# EAGLE design Ece 473 Lab 4 Pre-Amp (EAGLE 9.5.1)
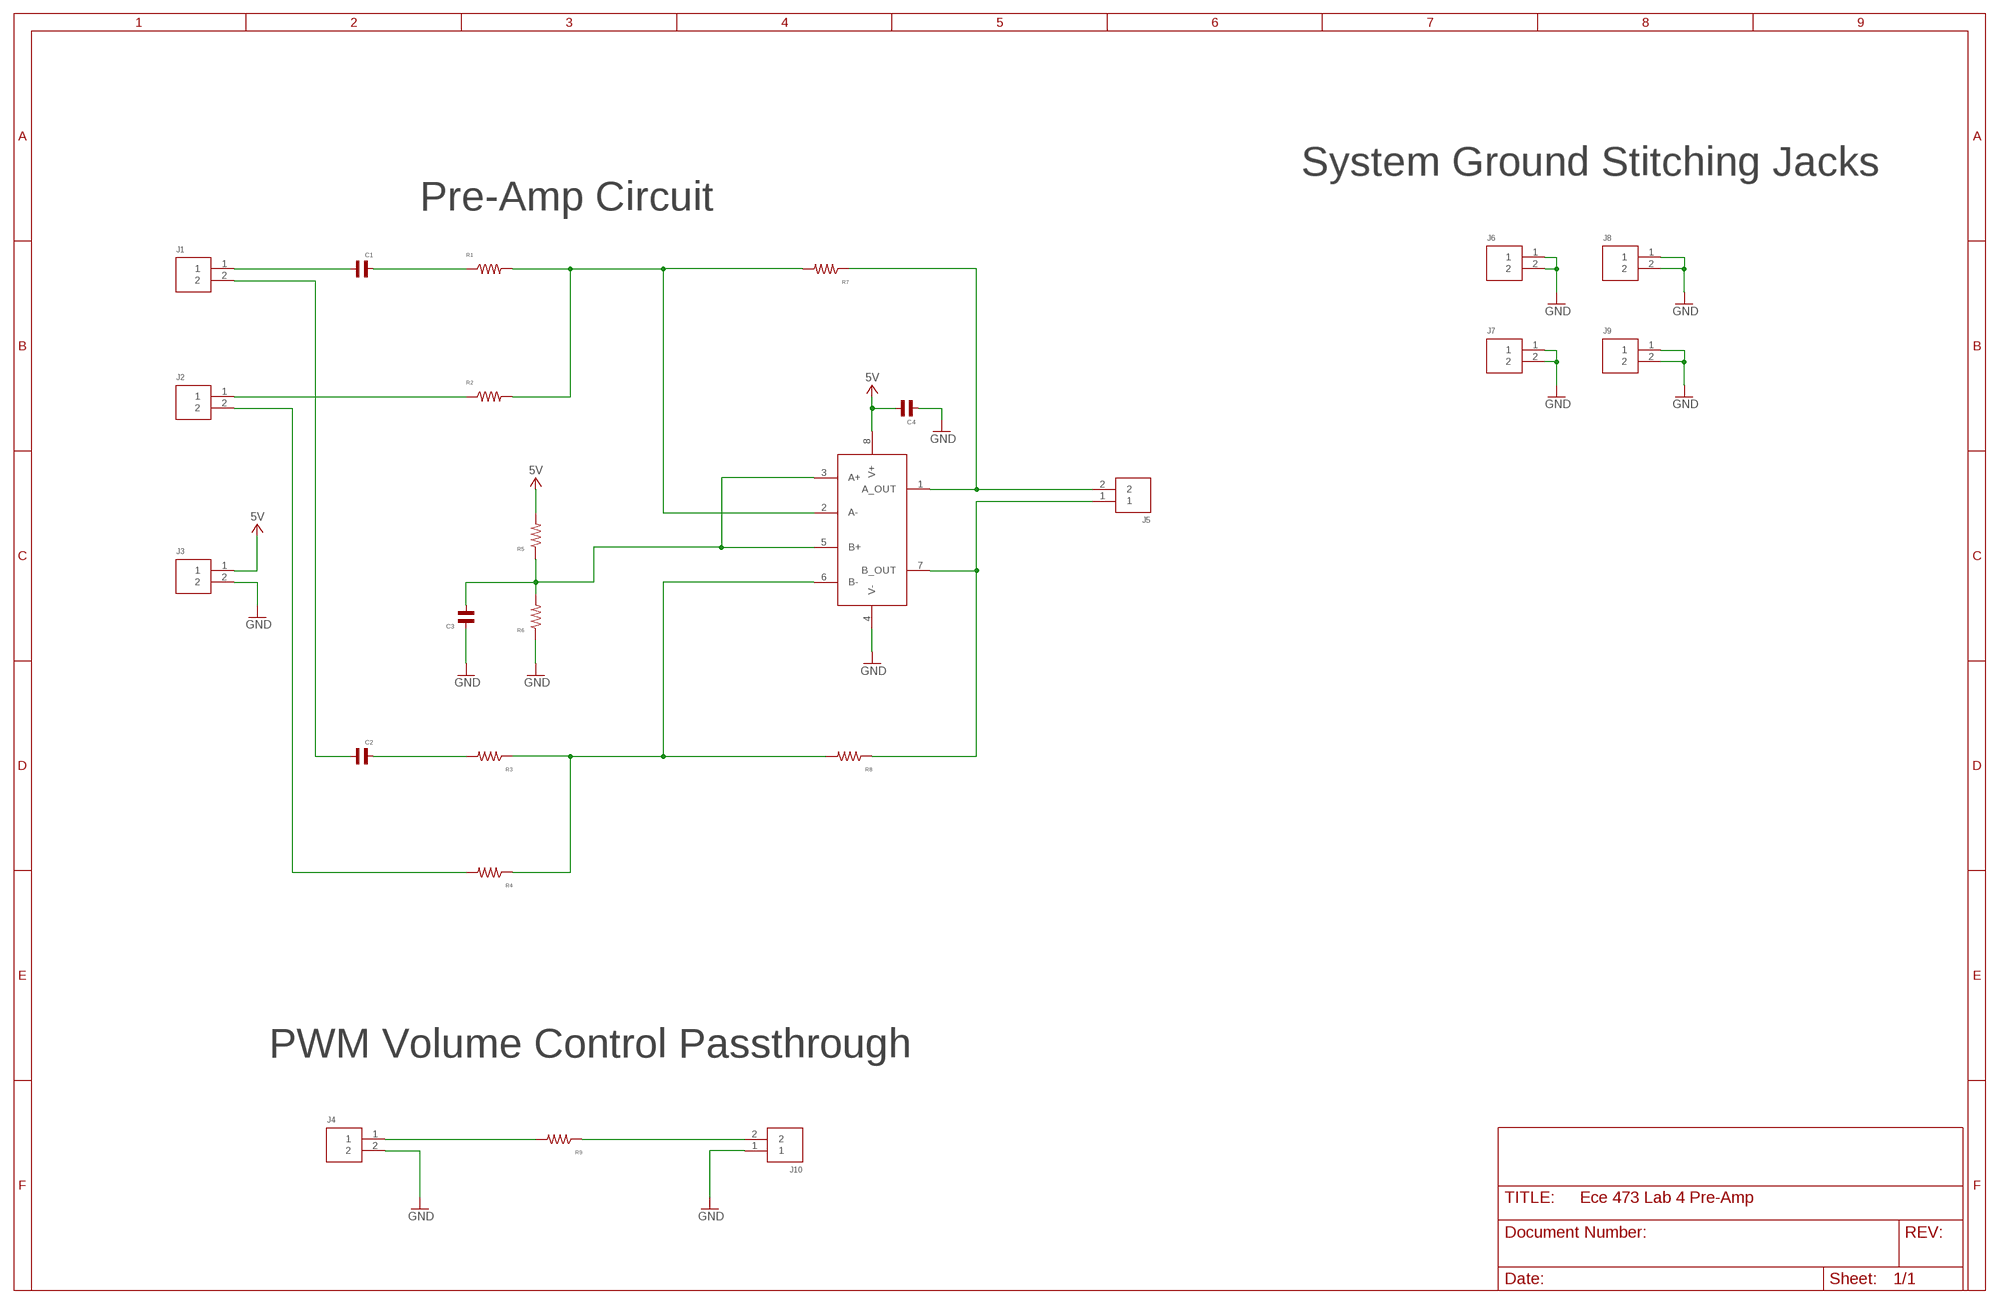
[diagram p0: schematic, sheet 1]

## Parts
C1  0.1uF  CAPACITOR_0.1UF_THROUGH-HOLE  [CAP_THROUGH-HOLE]
C2  0.1uF  CAPACITOR_0.1UF_THROUGH-HOLE  [CAP_THROUGH-HOLE]
C3  0.1uF  CAPACITOR_0.1UF_THROUGH-HOLE  [CAP_THROUGH-HOLE]
C4  0.1uF  CAPACITOR_0.1UF_THROUGH-HOLE  [CAP_THROUGH-HOLE]
J1  2x1  CONNECTOR-2_2X1  [HDRV2W64P254_1X2_467X234X838B]
J2  2x1  CONNECTOR-2_2X1  [HDRV2W64P254_1X2_467X234X838B]
J3  2x1  CONNECTOR-2_2X1  [HDRV2W64P254_1X2_467X234X838B]
J4  2x1  CONNECTOR-2_2X1  [HDRV2W64P254_1X2_467X234X838B]
J5  2x1  CONNECTOR-2_2X1  [HDRV2W64P254_1X2_467X234X838B]
J6  2x1  CONNECTOR-2_2X1  [HDRV2W64P254_1X2_467X234X838B]
J7  2x1  CONNECTOR-2_2X1  [HDRV2W64P254_1X2_467X234X838B]
J8  2x1  CONNECTOR-2_2X1  [HDRV2W64P254_1X2_467X234X838B]
J9  2x1  CONNECTOR-2_2X1  [HDRV2W64P254_1X2_467X234X838B]
J10  2x1  CONNECTOR-2_2X1  [HDRV2W64P254_1X2_467X234X838B]
R1  200k  RESISTOR_200K_THROUGH-HOLE  [RESISTOR_THROUGH-HOLE]
R2  3k  RESISTOR_3K_THROUGH-HOLE  [RESISTOR_THROUGH-HOLE]
R3  RESISTOR_THROUGH-HOLE  [RESISTOR_THROUGH-HOLE]
R4  3k  RESISTOR_3K_THROUGH-HOLE  [RESISTOR_THROUGH-HOLE]
R5  100k  RESISTOR_100K_THROUGH-HOLE  [RESISTOR_THROUGH-HOLE]
R6  100k  RESISTOR_100K_THROUGH-HOLE  [RESISTOR_THROUGH-HOLE]
R7  10k  RESISTOR_10K_THROUGH-HOLE  [RESISTOR_THROUGH-HOLE]
R8  10k  RESISTOR_10K_THROUGH-HOLE  [RESISTOR_THROUGH-HOLE]
R9  100k  RESISTOR_100K_THROUGH-HOLE  [RESISTOR_THROUGH-HOLE]
U1  LMC6032  OP-AMPLMC6032_PDIP-8PIN  [PDIP-8PIN]

## Nets
5V: C4.2 J3.1 R5.2 U1.8(V+)
GND: C3.1 C4.1 J3.2 J4.2 J6.1 J6.2 J7.1 J7.2 J8.1 J8.2 J9.1 J9.2 J10.1 R6.1 U1.4(V-)
N$1: C3.2 R5.1 R6.2 U1.3(A+) U1.5(B+)
N$2: J2.1 R2.1
N$3: C1.1 J1.1
N$4: C1.2 R1.1
N$5: J2.2 R4.2
N$6: R1.2 R2.2 R7.2 U1.2(A-)
N$7: J5.2 R7.1 U1.1(A_OUT)
N$8: J5.1 R8.1 U1.7(B_OUT)
N$9: C2.1 J1.2
N$10: C2.2 R3.2
N$11: R3.1 R4.1 R8.2 U1.6(B-)
N$12: J4.1 R9.2
N$13: J10.2 R9.1

## Notes on the sheet
- System Ground Stitching Jacks
- Pre-Amp Circuit
- PWM Volume Control Passthrough

## Library data of the parts
C1-C4 = OSU Senior Design:CAPACITOR; MPN: K104M15X7RF53L2
J1-J10 = OSU Senior Design:CONNECTOR-2
R1-R9 = OSU Senior Design:RESISTOR
U1 = OSU Senior Design:OP-AMP; MPN: LMC6032IN/NOPB

## Board
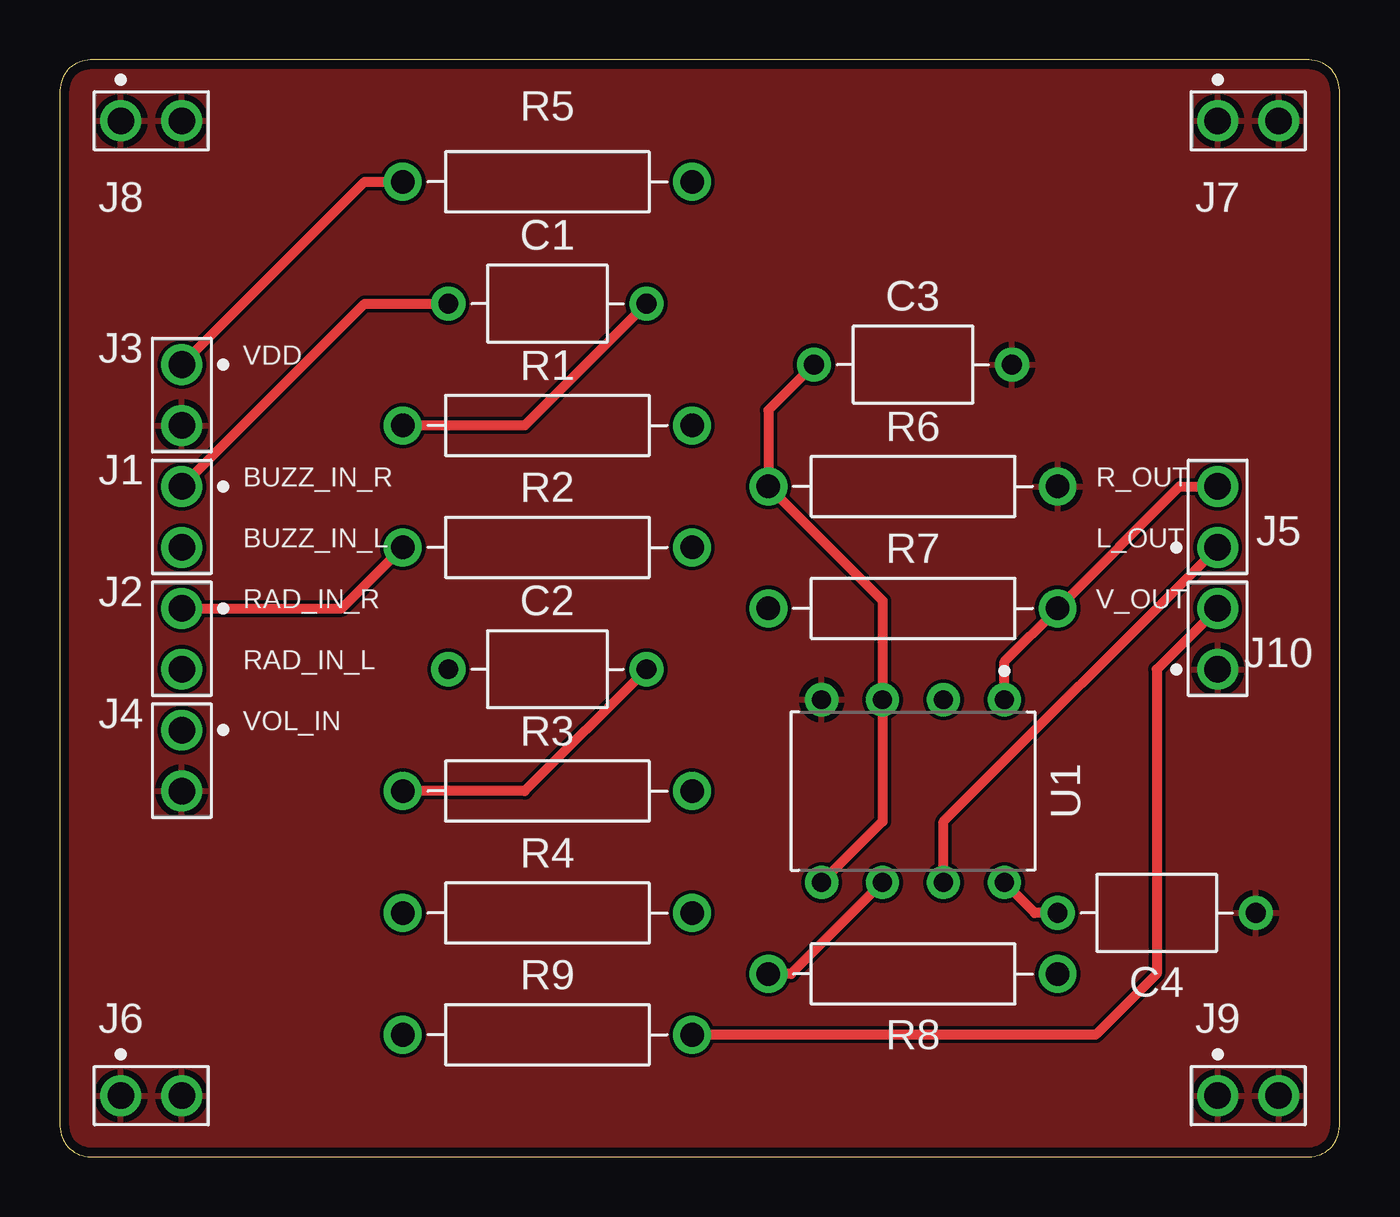
[diagram p1: board, top side]
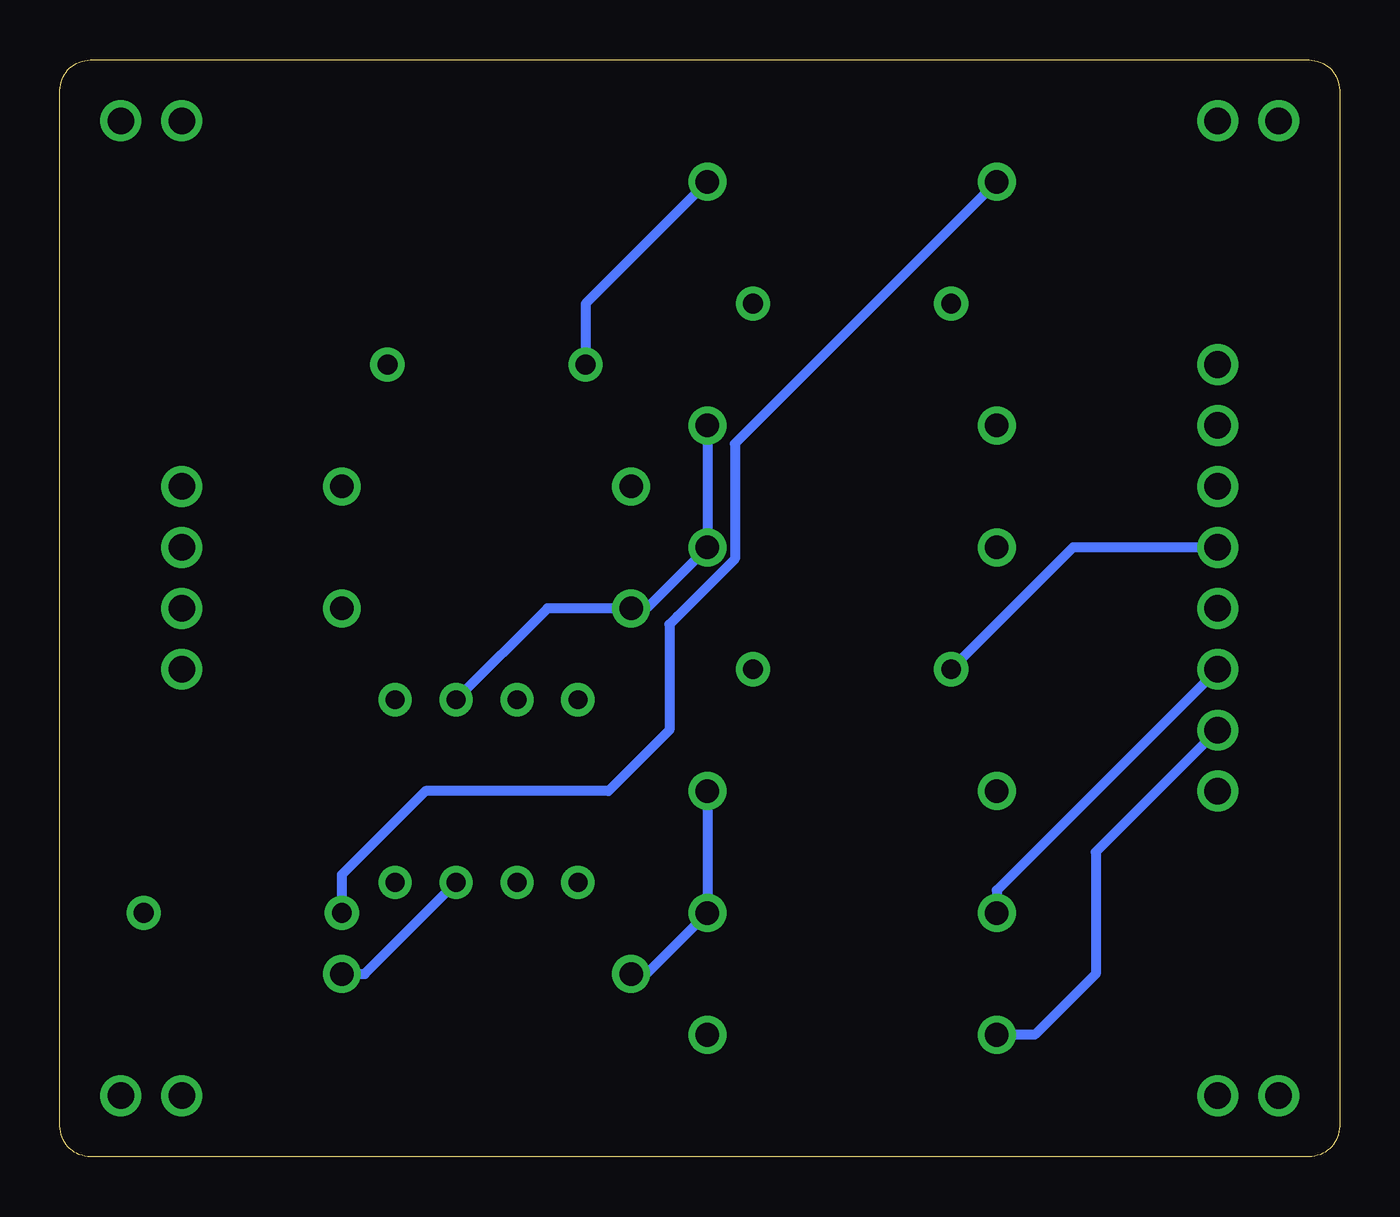
[diagram p2: board, bottom side, seen from below]

Size 53.34 x 45.72 mm. Coordinates in mm from the lower left corner, seen from the top.
Outline: 0,44.45 0,1.27 arc90 1.27,0 52.07,0 arc90 53.34,1.27 53.34,44.45 arc90 52.07,45.72 1.27,45.72 arc90 0,44.45
Copper layers (1*16): Top 0.035559375mm / dielectric 1.6mm / Bottom 0.035559375mm
Design rules "oshpark-2layer": minimum track width 6mil, minimum drill 10mil, track to track 6mil, track to pad 6mil, pad to pad 6mil, via to via 6mil, smd to smd 6mil, copper to edge 15mil, drill to drill 6mil, minimum pad ring 5mil, minimum via ring 5mil, stop-mask expansion 2.5mil, vias tented up to drill 0mil, thermal gap 10mil

### Footprints (pad centres in the part's own frame; a part is rotated, then mirrored left to right if it is on the bottom)
CAP_THROUGH-HOLE = drill 0.83 pad 1.43: 1 -4.13,0; 2 4.13,0
HDRV2W64P254_1X2_467X234X838B = drill 1.105 pad 1.705: 1 0,0; 2 2.54,0
RESISTOR_THROUGH-HOLE = drill 0.98 pad 1.58: 1 -6.03,0; 2 6.03,0
PDIP-8PIN = drill 0.786 pad 1.386: 1 -3.81,3.81; 2 -3.81,1.27; 3 -3.81,-1.27; 4 -3.81,-3.81; 5 3.81,-3.81; 6 3.81,-1.27; 7 3.81,1.27; 8 3.81,3.81

### Placement (x,y rotation side)
C1  20.32,35.56 0 top
C2  20.32,20.32 0 top
C3  35.56,33.02 180 top
C4  45.72,10.16 180 top
J1  5.08,27.94 270 top
J2  5.08,22.86 270 top
J3  5.08,33.02 270 top
J4  5.08,17.78 270 top
J5  48.26,25.4 90 top
J6  2.54,2.54 0 top
J7  48.26,43.18 0 top
J8  2.54,43.18 0 top
J9  48.26,2.54 0 top
J10  48.26,20.32 90 top
R1  20.32,30.48 0 top
R2  20.32,25.4 0 top
R3  20.32,15.24 180 top
R4  20.32,10.16 180 top
R5  20.32,40.64 180 top
R6  35.56,27.94 180 top
R7  35.56,22.86 180 top
R8  35.56,7.62 180 top
R9  20.32,5.08 180 top
U1  35.56,15.24 270 top

### Tracks (layer width: path | path; a pad name or v marks a point on that pad's centre or on a via)
5V
  Top 0.406: J3.1 12.7,40.64 R5.2 | C4.2 40.64,10.16 U1.8
  Bottom 0.406: R5.2 25.2,29.73 25.2,24.93 27.61,22.52 | 27.61,22.52 27.94,22.19 | C4.2 41.59,11.75 38.1,15.24 30.48,15.24 27.94,17.78 27.94,22.19 | 27.61,22.52 27.94,22.19
GND
  pour Top: -5.08,48.26 55.88,48.26 55.88,-2.54 -5.08,-2.54
N$1
  Top 0.406: U1.5 34.29,13.97 U1.3 34.29,23.18 R6.2 29.53,31.12 C3.2
  Bottom 0.406: R5.1 31.43,35.56 C3.2
N$2
  Top 0.406: J2.1 11.75,22.86 R2.1
N$3
  Top 0.406: J1.1 12.7,35.56 C1.1
N$4
  Top 0.406: C1.2 19.37,30.48 R1.1
N$5
  Bottom 0.406: J2.2 14.29,11.11 R4.2
N$6
  Bottom 0.406: R1.2 R2.2 28.89,22.86 R7.2 33.02,22.86 U1.2
N$7
  Top 0.406: U1.1 39.37,20.64 R7.1 46.67,27.94 J5.2
N$8
  Top 0.406: U1.7 36.83,13.97 J5.1
  Bottom 0.406: R8.1 40.64,7.62 U1.7
N$9
  Bottom 0.406: J1.2 11.11,25.4 C2.1
N$10
  Top 0.406: C2.2 19.37,15.24 R3.2
N$11
  Top 0.406: U1.6 30.48,7.62 R8.2
  Bottom 0.406: R3.1 R4.1 28.89,7.62 R8.2
N$12
  Bottom 0.406: J4.1 10.16,12.7 10.16,7.62 12.7,5.08 R9.2
N$13
  Top 0.406: J10.2 45.72,20.32 45.72,7.62 43.18,5.08 R9.1

### Text on the board
tPlace: VDD | BUZZ_IN_R | R_OUT | BUZZ_IN_L | L_OUT | RAD_IN_R | V_OUT | RAD_IN_L | VOL_IN